# Altium schematic sheet L-Stick_sheet3_misc.SchDoc: L-Stick - Miscellaneous
size A4; DocumentNumber: 3; Revision: 1.0.0; SheetNumber: 3; SheetTotal: 5; DrawnBy: SU; DocumentSize: A4; PCAName: L-Stick
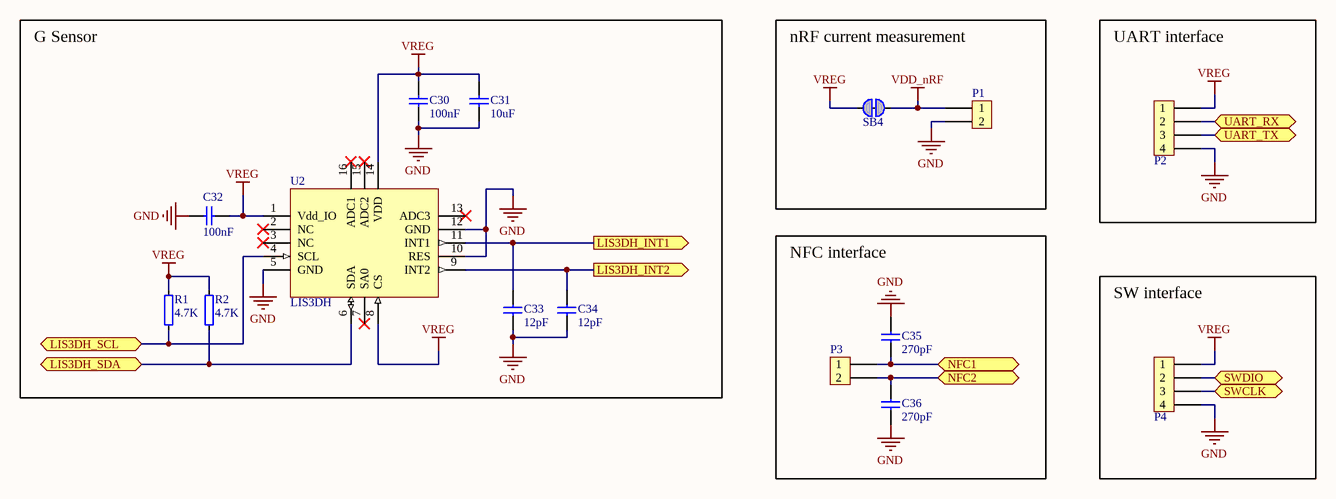
[diagram p0: L-Stick_sheet3_misc.SchDoc]

## Parts
C30  100nF  [0402C]
C31  10uF  [0603C]
C32  100nF  [0402C]
C33  12pF  [0402C]
C34  12pF  [0402C]
C35  270pF  [0402C]
C36  270pF  [0402C]
P1  (no value)  [LEG_2]  (no BOM)
P2  Header_4_2.54  [HEADER_4]  (value not drawn)
P3  (no value)  [TP_2x1mm_TH]  (no BOM)
P4  Header_4_2.54  [HEADER_4]  (value not drawn)
R1  4.7K  [0402R]
R2  4.7K  [0402R]
SB4  Solderbridge  [Solderbridge_Shorted]  (value not drawn)  (net tie, no BOM)
U2  LIS3DH  [LGA-16]

## Blocks framed on the sheet
G Sensor: C30-C34 R1 R2 U2
nRF current measurement: P1 SB4
UART interface: P2
NFC interface: C35 C36 P3
SW interface: P4

## Ports
LIS3DH_INT1 (out), LIS3DH_INT2 (out), LIS3DH_SCL (bidir), LIS3DH_SDA (bidir), NFC1 (bidir), NFC2 (bidir), SWCLK (bidir), SWDIO (bidir), UART_RX (bidir), UART_TX (bidir)

## Nets
GND: C30.1 C31.1 C32.1 C33.1 C34.1 C35.2 C36.1 P1.2 P2.4 P4.4 U2.5(GND) U2.10(RES) U2.12(GND)
VDD_nRF: P1.1 SB4.2
VREG: C30.2 C31.2 C32.2 P2.1 P4.1 R1.2 R2.2 SB4.1 U2.1(Vdd_IO) U2.8(CS) U2.14(VDD)
LIS3DH_INT1: C33.2 U2.11(INT1) ; port LIS3DH_INT1
LIS3DH_INT2: C34.2 U2.9(INT2) ; port LIS3DH_INT2
LIS3DH_SCL: R1.1 U2.4(SCL) ; port LIS3DH_SCL
LIS3DH_SDA: R2.1 U2.6(SDA) ; port LIS3DH_SDA
NFC1: C35.1 P3.1 ; port NFC1
NFC2: C36.2 P3.2 ; port NFC2
SWCLK: P4.3 ; port SWCLK
SWDIO: P4.2 ; port SWDIO
UART_RX: P2.2 ; port UART_RX
UART_TX: P2.3 ; port UART_TX

Not connected (* = marked no-connect by the designer): U2 2(NC)* 3(NC)* 7(SA0)* 13(ADC3)* 15(ADC2)* 16(ADC1)*

## Notes on the sheet
- Title
- Size:
- Date:
- A4
- Number:
- Time:
- Revision:
- Sheet
- of
- File:

## Library data of the parts
C30 C32-C36 = CAP_0402: Capacitor
  C30 C32: Value: 100nF
  C33 C34: Value: 12pF
  C35 C36: Value: 270pF
C31 = CAP_0603: Capacitor; Value: 10uF
P1 P3 = LEG_2: External Solder Pad
P2 P4 = Header_4: Value: Header_4_2.54
R1 R2 = RES_0402: Resistor; Value: 4.7K
SB4 = SOLDERBRIDGE_SHORTED: Shorted Solderbridge; Value: Solderbridge
U2 = LIS3DH: Chip, LIS3DH, 3-axis - ±2g/±4g/±8g/±16g digital output femto accelerometer; Value: LIS3DH